# Altium schematic sheet Rev Hestory.SchDoc
size A; DocumentNumber: 7; SheetNumber: 7; SheetTotal: 7
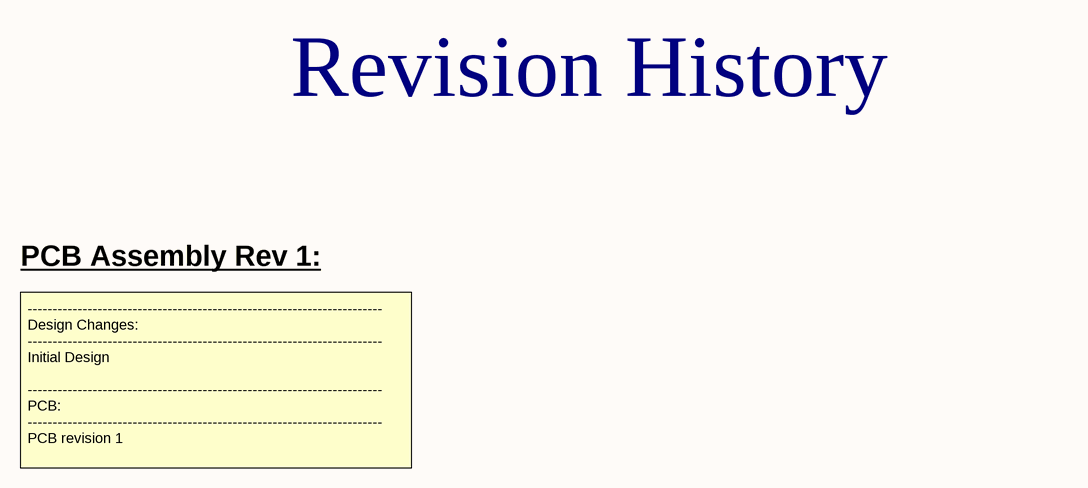
[diagram p0: Rev Hestory.SchDoc]

## Notes on the sheet
- Revision History
- PCB Assembly Rev 1:
- -----------------------------------------------------------------------
  Design Changes:
  -----------------------------------------------------------------------
  Initial Design
  -----------------------------------------------------------------------
  PCB:
  -----------------------------------------------------------------------
  PCB revision 1